# EAGLE design MCP3424_ADC_breakout (EAGLE 5.06)
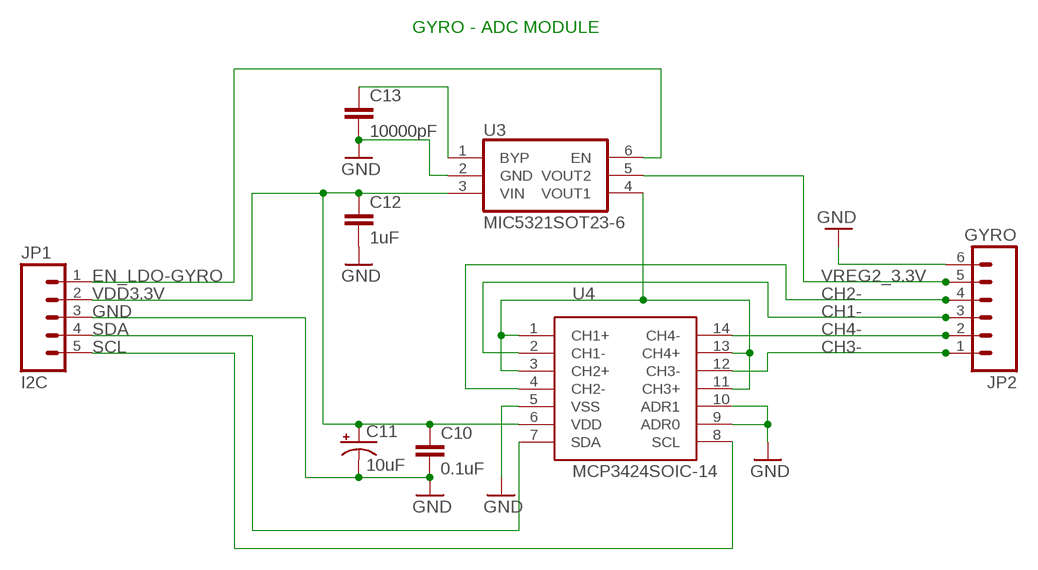
[diagram p0: schematic, sheet 1]

## Parts
C10  0.1uF  CAP0603-CAP  [0603-CAP]
C11  10uF  CAP_POL1206  [EIA3216]
C12  1uF  CAP0603-CAP  [0603-CAP]
C13  10000pF  CAP0603-CAP  [0603-CAP]
JP1  I2C  M05SMD  [1X05-SMD]
JP2  GYRO  M06SMD  [1X06-SMD]
U3  MIC5321SOT23-6  [SOT23-6]
U4  MCP3424SOIC-14  [14-SOIC]

## Nets
CH1-: JP2.3 U4.2(CH1-)
CH2-: JP2.4 U4.4(CH2-)
CH3-: JP2.1 U4.12(CH3-)
CH4-: JP2.2 U4.14(CH4-)
EN_LDO-GYRO: JP1.1 U3.6(EN)
GND: C10.2 C11.C(-) C12.2 C13.2 JP1.3 JP2.6 U3.2(GND) U4.5(VSS) U4.9(ADR0) U4.10(ADR1)
N$5: C13.1 U3.1(BYP)
SCL: JP1.5 U4.8(SCL)
SDA: JP1.4 U4.7(SDA)
VDD3.3V: C10.1 C11.A(+) C12.1 JP1.2 U3.3(VIN) U4.6(VDD)
VREG1_3.3V: U3.4(VOUT1) U4.1(CH1+) U4.3(CH2+) U4.11(CH3+) U4.13(CH4+)
VREG2_3.3V: JP2.5 U3.5(VOUT2)

## Notes on the sheet
- GYRO - ADC MODULE

## Library data of the parts
C10 C12 C13 = haptic-inu:CAP: Capacitor Standard 0603 ceramic capacitor, and 0.1" leaded capacitor.
C11 = haptic-inu:CAP_POL: Capacitor Polarized These are standard SMD and PTH capacitors. Normally 10uF, 47uF, and 100uF in electrolytic and tantalum varieties. Always verify the external diameter of the through hole cap, it varies with capacity, voltage, and manufacturer. The EIA devices should be standard.
JP1 = haptic-inu:M05: Header 5 Standard 5-pin 0.1" header. Use with straight break away headers (SKU : PRT-00116), right angle break away headers (PRT-00553), swiss pins (PRT-00743), machine pins (PRT-00117), and female headers (PRT-00115). Molex polarized connector foot print use with SKU : PRT-08230 with associated crimp pins and housings.
JP2 = haptic-inu:M06: Header 6 Standard 6-pin 0.1" header. Use with straight break away headers (SKU : PRT-00116), right angle break away headers (PRT-00553), swiss pins (PRT-00743), machine pins (PRT-00117), and female headers (PRT-00115). Molex polarized connector foot print use with SKU : PRT-08094 with associated crimp pins and housings. NOTES ON THE VARIANTS LOCK and LOCK_LONGPADS... This footprint was designed to help hold the alignment of a through-hole component (i.e. 6-pin header) while soldering it into place. You may notice that each hole has been shifted either up or down by 0.005 of an inch from it's more standard position (which is a perfectly straight line). This slight alteration caused the pins (the squares in the middle) to touch the edges of the holes. Because they are alternating, it causes a "brace" to hold the component in place. 0.005 has proven to be the perfect amount of "off-center" position when using our standard breakaway headers. Although looks a little odd when you look at the bare footprint, once you have a header in there, the alteration is very hard to notice. Also, if you push a header all the way into place, it is covered up entirely on the bottom side. This idea of altering the position of holes to aid alignment will be further integrated into the Sparkfun Library for other footprints. It can help hold any component with 3 or more connection pins.
U3 = haptic-inu:MIC5321: Voltage Regulator LDO Dual, High Performancs 150mA uCap ULDO
U4 = haptic-inu:MCP3424

## Board
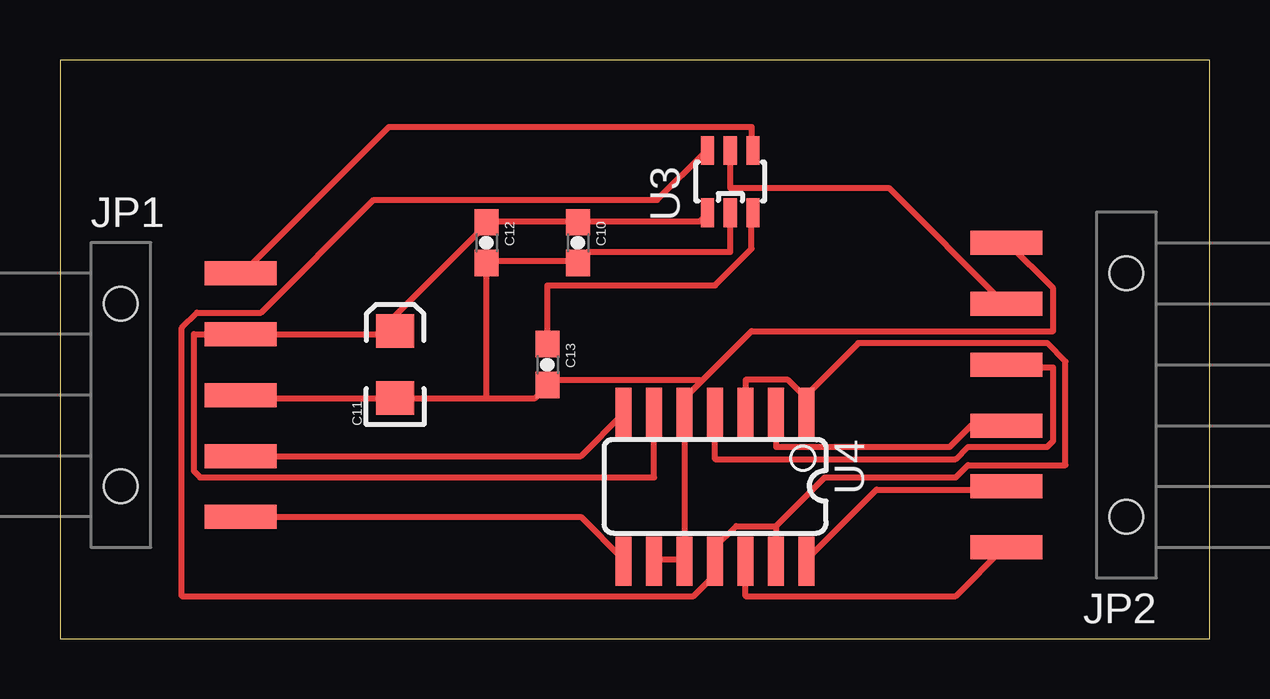
[diagram p1: board, top side]

Size 47.93 x 24.12 mm. Coordinates in mm from the lower left corner, seen from the top.
Outline: 0,0 47.93,0 47.93,24.12 0,24.12 0,0
Copper layers (1*16): Top 0.035mm / dielectric 1.5mm / Bottom 0.035mm
Design rules "default": minimum track width 10mil, minimum drill 24mil, track to track 8mil, track to pad 8mil, pad to pad 8mil, via to via 8mil, smd to smd 8mil, copper to edge 40mil, drill to drill 8mil, minimum pad ring 10mil, minimum via ring 8mil, stop-mask expansion 4mil, vias tented up to drill 0mil, thermal gap 10mil

### Footprints (pad centres in the part's own frame; a part is rotated, then mirrored left to right if it is on the bottom)
0603-CAP = smd 1.1 x 1: 1 -0.85,0; 2 0.85,0
EIA3216 = smd 1.4 x 1.6: A 1.4,0; C -1.4,0
1X05-SMD = smd 1 x 3: 1 -5.08,5; 2 -2.54,5; 3 0,5; 4 2.54,5; 5 5.08,5 | hole 1.4: -3.81,0; 3.81,0
1X06-SMD = smd 1 x 3: 1 -6.35,5; 2 -3.81,5; 3 -1.27,5; 4 1.27,5; 5 3.81,5; 6 6.35,5 | hole 1.4: -5.08,0; 5.08,0
SOT23-6 = smd 0.55 x 1.2: 1 0.95,-1.3; 2 0,-1.3; 3 -0.95,-1.3; 4 -0.95,1.3; 5 0,1.3; 6 0.95,1.3
14-SOIC = smd 0.66 x 2.032: 1 -4.445,-3.09; 2 -3.175,-3.09; 3 -1.905,-3.09; 4 -0.635,-3.09; 5 0.635,-3.09; 6 1.905,-3.09; 7 3.175,-3.09; 8 3.175,3.111; 9 1.905,3.111; 10 0.635,3.111; 11 -0.635,3.111; 12 -1.905,3.111; 13 -3.175,3.111; 14 -4.445,3.111

### Placement (x,y rotation side)
C10  21.59,16.51 270 top
C11  13.97,11.43 90 top
C12  17.78,16.51 270 top
C13  20.32,11.43 270 top
JP1  2.54,10.16 270 top
JP2  44.45,10.16 90 top
U3  27.94,19.05 0 top
U4  26.67,6.35 180 top

### Tracks (layer width: path | path; a pad name or v marks a point on that pad's centre or on a via)
CH1-
  Top 0.254: U4.2 29.84,8 37.08,8 37.97,8.89 JP2.3
CH2-
  Top 0.254: U4.4 27.3,7.49 37.34,7.49 37.85,8 41.15,8 41.4,8.26 41.4,11.3 39.62,11.3 39.5,11.43 JP2.4
CH3-
  Top 0.254: U4.12 28.57,1.78 37.34,1.78 39.37,3.81 JP2.1
CH4-
  Top 0.254: U4.14 31.11,3.3 34.04,6.22 39.24,6.22 39.37,6.35 JP2.2
EN_LDO-GYRO
  Top 0.254: U3.6 28.83,20.45 28.83,21.34 13.72,21.34 7.62,15.24 JP1.1
GND
  Top 0.254: 21.59,15.75 17.78,15.75 C12.2 17.78,10.03 | 21.59,15.75 21.97,16.13 27.94,16.13 U3.2 | 21.59,15.75 C10.2 | 26.04,3.3 24.77,3.3 U4.9 | 26.04,3.3 U4.5 26.04,10.03 26.73,10.73 | 26.04,3.3 U4.10 | C11.C 17.78,10.03 | 17.78,10.03 19.81,10.03 20.32,10.54 C13.2 20.32,10.67 20.45,10.79 26.67,10.79 26.73,10.73 | C11.C 7.75,10.03 7.62,10.16 JP1.3 | C11.C | 26.73,10.73 28.83,12.83 41.4,12.83 41.4,14.61 39.5,16.51 JP2.6
N$5
  Top 0.254: U3.1 28.83,17.65 28.83,16.26 27.3,14.73 20.32,14.73 C13.1
SCL
  Top 0.254: U4.8 23.5,3.3 21.72,5.08 JP1.5
SDA
  Top 0.254: U4.7 23.5,9.4 21.72,7.62 JP1.4
VDD3.3V
  Top 0.254: 21.59,17.4 17.78,17.4 C12.1 17.78,17.27 13.21,12.7 | 21.59,17.4 26.67,17.4 26.92,17.65 U3.3 | 21.59,17.4 C10.1 | 13.21,12.7 13.84,12.7 C11.A 13.21,12.7 | 13.21,12.7 JP1.2 5.59,12.7 5.59,6.99 5.84,6.73 24.77,6.73 U4.6
VREG1_3.3V
  Top 0.254: U4.3 28.57,10.79 30.35,10.79 31.11,10.03 U4.1 31.11,10.16 33.27,12.32 41.15,12.32 41.91,11.56 41.91,7.24 37.85,7.24 37.34,6.73 31.88,6.73 29.84,4.7 | U3.4 26.92,20.32 24.89,18.29 13.08,18.29 8.38,13.59 5.71,13.59 5.08,12.95 5.08,1.78 26.42,1.78 27.3,2.67 U4.11 27.3,3.81 28.19,4.7 29.84,4.7 | 29.84,4.7 U4.13
VREG2_3.3V
  Top 0.254: U3.5 27.94,18.8 34.54,18.8 39.37,13.97 JP2.5